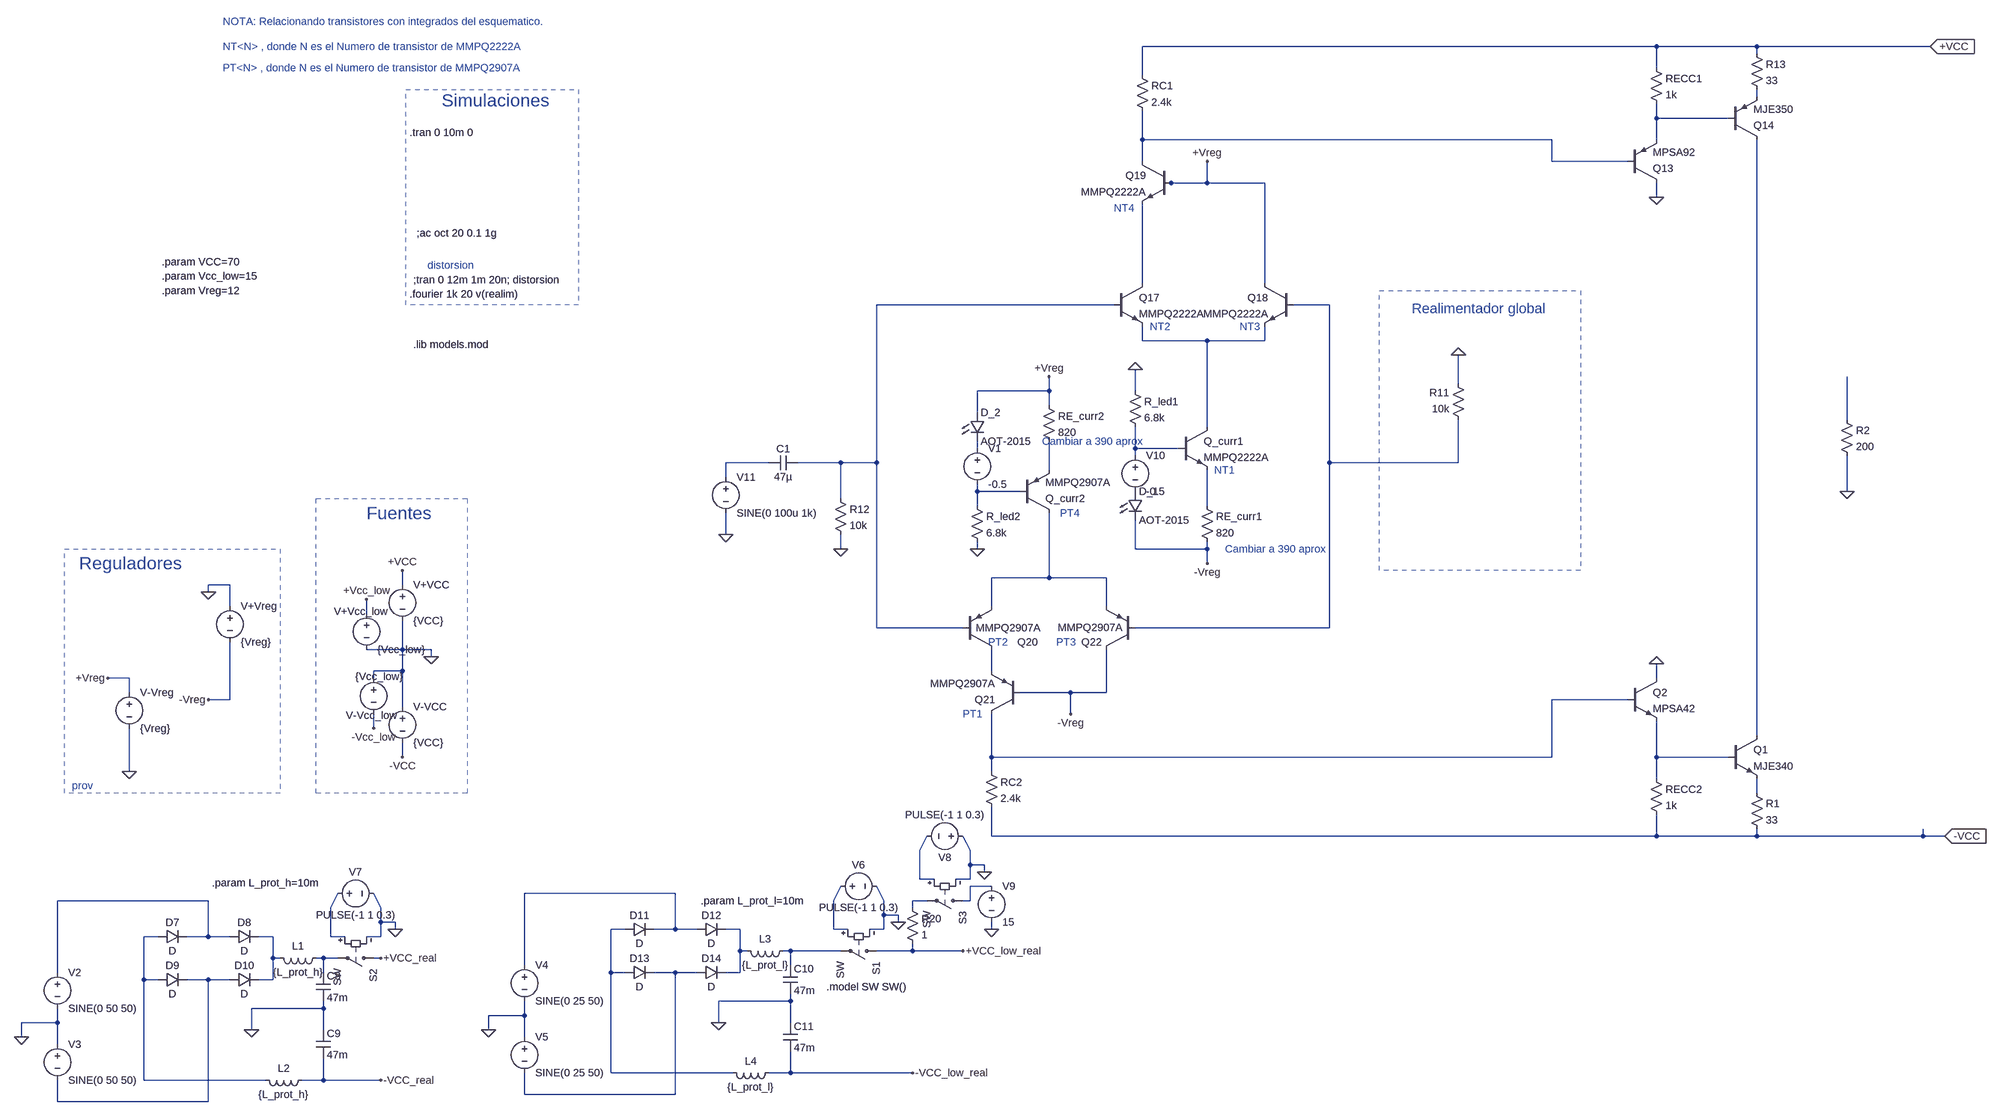
[diagram p0: schematic segunda-etapa.asc]
segunda-etapa.asc, the LTspice schematic file:
Version 4
SHEET 1 6132 1744
WIRE 1680 -752 464 -752
WIRE 1904 -752 1680 -752
WIRE 2688 -752 1904 -752
WIRE 1904 -736 1904 -752
WIRE 1680 -704 1680 -752
WIRE 464 -688 464 -752
WIRE 1904 -640 1904 -656
WIRE 1680 -592 1680 -624
WIRE 1840 -592 1680 -592
WIRE 464 -544 464 -608
WIRE 1392 -544 464 -544
WIRE 1680 -544 1680 -592
WIRE 464 -496 464 -544
WIRE 1392 -496 1392 -544
WIRE 1616 -496 1392 -496
WIRE 528 -448 512 -448
WIRE 608 -448 608 -496
WIRE 608 -448 528 -448
WIRE 736 -448 608 -448
WIRE 1680 -416 1680 -448
WIRE 464 -224 464 -400
WIRE 736 -224 736 -448
WIRE 400 -176 -128 -176
WIRE 880 -176 800 -176
WIRE 464 -96 464 -128
WIRE 608 -96 464 -96
WIRE 736 -96 736 -128
WIRE 736 -96 608 -96
WIRE 1184 0 1184 -64
WIRE 256 16 256 -16
WIRE 256 16 96 16
WIRE 448 16 448 -32
WIRE 256 48 256 16
WIRE 96 64 96 16
WIRE 2336 80 2336 -16
WIRE 608 96 608 -96
WIRE 96 144 96 128
WIRE 448 144 448 96
WIRE 544 144 448 144
WIRE 448 160 448 144
WIRE -368 176 -464 176
WIRE -208 176 -304 176
WIRE -128 176 -128 -176
WIRE -128 176 -208 176
WIRE 880 176 880 -176
WIRE 1184 176 1184 80
WIRE 1184 176 880 176
WIRE 256 192 256 128
WIRE -464 208 -464 176
WIRE 96 240 96 224
WIRE 192 240 96 240
WIRE 2336 240 2336 160
WIRE -208 256 -208 176
WIRE 96 272 96 240
WIRE 608 272 608 192
WIRE -464 336 -464 288
WIRE -208 368 -208 336
WIRE 96 368 96 352
WIRE 448 368 448 304
WIRE 608 368 608 352
WIRE 608 368 448 368
WIRE 608 400 608 368
WIRE 256 432 256 288
WIRE 256 432 128 432
WIRE 384 432 256 432
WIRE -1568 448 -1616 448
WIRE -1184 448 -1184 416
WIRE -1616 464 -1616 448
WIRE -1568 496 -1568 448
WIRE 128 496 128 432
WIRE 384 496 384 432
WIRE -1264 512 -1264 480
WIRE -128 544 -128 176
WIRE 64 544 -128 544
WIRE 880 544 880 176
WIRE 880 544 448 544
WIRE -1184 592 -1184 528
WIRE -1184 592 -1264 592
WIRE -1120 592 -1184 592
WIRE -1120 608 -1120 592
WIRE -1184 640 -1184 592
WIRE -1184 640 -1248 640
WIRE 128 640 128 592
WIRE -1792 656 -1840 656
WIRE -1248 656 -1248 640
WIRE 1680 656 1680 624
WIRE -1792 688 -1792 656
WIRE 304 688 192 688
WIRE 384 688 384 592
WIRE 384 688 304 688
WIRE -1568 704 -1568 576
WIRE -1568 704 -1616 704
WIRE 1616 704 1392 704
WIRE -1184 720 -1184 640
WIRE 304 736 304 688
WIRE -1248 768 -1248 736
WIRE 1904 784 1904 -544
WIRE -1184 832 -1184 800
WIRE 128 832 128 736
WIRE 1392 832 1392 704
WIRE 1392 832 128 832
WIRE 1680 832 1680 752
WIRE 1840 832 1680 832
WIRE -1792 864 -1792 768
WIRE 128 864 128 832
WIRE 1680 880 1680 832
WIRE 1904 912 1904 880
WIRE 128 1008 128 944
WIRE 1680 1008 1680 960
WIRE 1680 1008 128 1008
WIRE 1904 1008 1904 992
WIRE 1904 1008 1680 1008
WIRE 2672 1008 2672 992
WIRE 2672 1008 1904 1008
WIRE 2720 1008 2672 1008
WIRE -32 1040 -16 1008
WIRE 80 1040 64 1008
WIRE 80 1072 80 1040
WIRE 112 1072 80 1072
WIRE 112 1088 112 1072
WIRE -32 1104 -32 1040
WIRE 0 1104 -32 1104
WIRE 80 1104 80 1072
WIRE 80 1104 48 1104
WIRE 128 1120 80 1120
WIRE -576 1136 -912 1136
WIRE -1616 1152 -1952 1152
WIRE -224 1152 -208 1120
WIRE -112 1152 -128 1120
WIRE -16 1152 -48 1152
WIRE 80 1152 80 1120
WIRE 80 1152 64 1152
WIRE -1344 1168 -1328 1136
WIRE -1232 1168 -1248 1136
WIRE -48 1168 -48 1152
WIRE -112 1184 -112 1152
WIRE -80 1184 -112 1184
WIRE -1232 1200 -1232 1168
WIRE -1200 1200 -1232 1200
WIRE -80 1200 -80 1184
WIRE -1200 1216 -1200 1200
WIRE -688 1216 -720 1216
WIRE -576 1216 -576 1136
WIRE -576 1216 -624 1216
WIRE -528 1216 -576 1216
WIRE -432 1216 -464 1216
WIRE -224 1216 -224 1152
WIRE -192 1216 -224 1216
WIRE -112 1216 -112 1184
WIRE -112 1216 -144 1216
WIRE 128 1216 128 1200
WIRE -1728 1232 -1760 1232
WIRE -1616 1232 -1616 1152
WIRE -1616 1232 -1664 1232
WIRE -1568 1232 -1616 1232
WIRE -1472 1232 -1504 1232
WIRE -1344 1232 -1344 1168
WIRE -1312 1232 -1344 1232
WIRE -1232 1232 -1232 1200
WIRE -1232 1232 -1264 1232
WIRE -432 1264 -432 1216
WIRE -416 1264 -432 1264
WIRE -320 1264 -336 1264
WIRE -208 1264 -320 1264
WIRE -48 1264 -48 1248
WIRE -48 1264 -128 1264
WIRE 64 1264 -48 1264
WIRE -1472 1280 -1472 1232
WIRE -1456 1280 -1472 1280
WIRE -1360 1280 -1376 1280
WIRE -1328 1280 -1360 1280
WIRE -1232 1280 -1248 1280
WIRE -912 1296 -912 1136
WIRE -320 1296 -320 1264
WIRE -1952 1312 -1952 1152
WIRE -1360 1312 -1360 1280
WIRE -720 1312 -720 1216
WIRE -688 1312 -720 1312
WIRE -576 1312 -624 1312
WIRE -528 1312 -576 1312
WIRE -432 1312 -432 1264
WIRE -432 1312 -464 1312
WIRE -1760 1328 -1760 1232
WIRE -1728 1328 -1760 1328
WIRE -1616 1328 -1664 1328
WIRE -1568 1328 -1616 1328
WIRE -1472 1328 -1472 1280
WIRE -1472 1328 -1504 1328
WIRE -320 1376 -320 1360
WIRE -320 1376 -480 1376
WIRE -1360 1392 -1360 1376
WIRE -1360 1392 -1520 1392
WIRE -912 1408 -912 1376
WIRE -912 1408 -992 1408
WIRE -1952 1424 -1952 1392
WIRE -1952 1424 -2032 1424
WIRE -480 1424 -480 1376
WIRE -320 1424 -320 1376
WIRE -1520 1440 -1520 1392
WIRE -1360 1440 -1360 1392
WIRE -992 1440 -992 1408
WIRE -2032 1456 -2032 1424
WIRE -912 1456 -912 1408
WIRE -1952 1472 -1952 1424
WIRE -720 1536 -720 1312
WIRE -448 1536 -720 1536
WIRE -320 1536 -320 1488
WIRE -320 1536 -368 1536
WIRE -48 1536 -320 1536
WIRE -1760 1552 -1760 1328
WIRE -1488 1552 -1760 1552
WIRE -1360 1552 -1360 1504
WIRE -1360 1552 -1408 1552
WIRE -1232 1552 -1360 1552
WIRE -912 1584 -912 1536
WIRE -576 1584 -576 1312
WIRE -576 1584 -912 1584
WIRE -1952 1600 -1952 1552
WIRE -1616 1600 -1616 1328
WIRE -1616 1600 -1952 1600
FLAG -1120 608 0
FLAG -1184 416 +VCC
FLAG -1264 480 +Vcc_low
FLAG -1248 768 -Vcc_low
FLAG -1184 832 -VCC
FLAG 2720 1008 -VCC
IOPIN 2720 1008 In
FLAG 2688 -752 +VCC
IOPIN 2688 -752 In
FLAG -208 368 0
FLAG 1680 -416 0
FLAG -1840 656 +Vreg
FLAG -1616 704 -Vreg
FLAG 608 -496 +Vreg
FLAG 608 400 -Vreg
FLAG 256 -16 +Vreg
FLAG 304 736 -Vreg
FLAG 96 368 0
FLAG 448 -32 0
FLAG -1792 864 0
FLAG -1616 464 0
FLAG -2032 1456 0
FLAG -1520 1440 0
FLAG -1232 1280 +VCC_real
FLAG -1232 1552 -VCC_real
FLAG -992 1440 0
FLAG -480 1424 0
FLAG 64 1264 +VCC_low_real
FLAG -48 1536 -VCC_low_real
FLAG -80 1200 0
FLAG -1200 1216 0
FLAG 112 1088 0
FLAG 128 1216 0
FLAG 1184 -64 0
FLAG 1680 624 0
FLAG 2336 240 0
FLAG -464 336 0
SYMBOL voltage -1248 640 R0
WINDOW 0 -62 99 Left 2
WINDOW 3 -41 12 Left 2
WINDOW 123 0 0 Left 2
WINDOW 39 0 0 Left 2
SYMATTR InstName V-Vcc_low
SYMATTR Value {Vcc_low}
SYMBOL voltage -1184 432 R0
WINDOW 123 0 0 Left 2
WINDOW 39 0 0 Left 2
SYMATTR InstName V+VCC
SYMATTR Value {VCC}
SYMBOL voltage -1264 496 R0
WINDOW 0 -72 11 Left 2
WINDOW 123 0 0 Left 2
WINDOW 39 0 0 Left 2
SYMATTR InstName V+Vcc_low
SYMATTR Value {Vcc_low}
SYMBOL voltage -1184 704 R0
WINDOW 123 0 0 Left 2
WINDOW 39 0 0 Left 2
SYMATTR InstName V-VCC
SYMATTR Value {VCC}
SYMBOL res 1200 96 R180
WINDOW 0 36 76 Left 2
WINDOW 3 36 40 Left 2
SYMATTR InstName R11
SYMATTR Value 10k
SYMBOL res -224 240 R0
SYMATTR InstName R12
SYMATTR Value 10k
SYMBOL pnp 1616 -448 M180
SYMATTR InstName Q13
SYMATTR Value MPSA92
SYMBOL pnp 1840 -544 M180
SYMATTR InstName Q14
SYMATTR Value MJE350
SYMBOL res 1888 -752 R0
SYMATTR InstName R13
SYMATTR Value 33
SYMBOL voltage -1568 480 R0
WINDOW 123 0 0 Left 2
WINDOW 39 0 0 Left 2
SYMATTR InstName V+Vreg
SYMATTR Value {Vreg}
SYMBOL npn 544 96 R0
SYMATTR InstName Q_curr1
SYMATTR Value MMPQ2222A
SYMBOL npn 400 -224 R0
SYMATTR InstName Q17
SYMATTR Value MMPQ2222A
SYMBOL npn 800 -224 M0
SYMATTR InstName Q18
SYMATTR Value MMPQ2222A
SYMBOL res 432 0 R0
SYMATTR InstName R_led1
SYMATTR Value 6.8k
SYMBOL res 592 256 R0
SYMATTR InstName RE_curr1
SYMATTR Value 820
SYMBOL LED 432 240 R0
SYMATTR InstName D_1
SYMATTR Value AOT-2015
SYMBOL res 448 -704 R0
SYMATTR InstName RC1
SYMATTR Value 2.4k
SYMBOL npn 528 -496 M0
SYMATTR InstName Q19
SYMATTR Value MMPQ2222A
SYMBOL res 240 32 R0
SYMATTR InstName RE_curr2
SYMATTR Value 820
SYMBOL pnp 192 288 M180
SYMATTR InstName Q_curr2
SYMATTR Value MMPQ2907A
SYMBOL pnp 64 592 M180
WINDOW 0 121 16 Left 2
WINDOW 3 29 48 Left 2
SYMATTR InstName Q20
SYMATTR Value MMPQ2907A
SYMBOL pnp 192 736 R180
SYMATTR InstName Q21
SYMATTR Value MMPQ2907A
SYMBOL res 112 848 R0
SYMATTR InstName RC2
SYMATTR Value 2.4k
SYMBOL pnp 448 592 R180
WINDOW 0 74 16 Left 2
WINDOW 3 28 49 Left 2
SYMATTR InstName Q22
SYMATTR Value MMPQ2907A
SYMBOL LED 80 64 R0
SYMATTR InstName D_2
SYMATTR Value AOT-2015
SYMBOL res 80 256 R0
SYMATTR InstName R_led2
SYMATTR Value 6.8k
SYMBOL res 1664 -720 R0
SYMATTR InstName RECC1
SYMATTR Value 1k
SYMBOL voltage -1792 672 R0
WINDOW 123 0 0 Left 2
WINDOW 39 0 0 Left 2
SYMATTR InstName V-Vreg
SYMATTR Value {Vreg}
SYMBOL voltage -1952 1296 R0
WINDOW 123 0 0 Left 2
WINDOW 39 0 0 Left 2
SYMATTR InstName V2
SYMATTR Value SINE(0 50 50)
SYMBOL diode -1728 1248 R270
WINDOW 0 32 32 VTop 2
WINDOW 3 0 32 VBottom 2
SYMATTR InstName D7
SYMBOL diode -1568 1248 R270
WINDOW 0 32 32 VTop 2
WINDOW 3 0 32 VBottom 2
SYMATTR InstName D8
SYMBOL diode -1728 1344 R270
WINDOW 0 32 32 VTop 2
WINDOW 3 0 32 VBottom 2
SYMATTR InstName D9
SYMBOL diode -1568 1344 R270
WINDOW 0 32 32 VTop 2
WINDOW 3 0 32 VBottom 2
SYMATTR InstName D10
SYMBOL cap -1376 1312 R0
SYMATTR InstName C8
SYMATTR Value 47m
SYMBOL voltage -1952 1456 R0
WINDOW 123 0 0 Left 2
WINDOW 39 0 0 Left 2
SYMATTR InstName V3
SYMATTR Value SINE(0 50 50)
SYMBOL cap -1376 1440 R0
SYMATTR InstName C9
SYMATTR Value 47m
SYMBOL voltage -912 1280 R0
WINDOW 123 0 0 Left 2
WINDOW 39 0 0 Left 2
SYMATTR InstName V4
SYMATTR Value SINE(0 25 50)
SYMBOL diode -688 1232 R270
WINDOW 0 32 32 VTop 2
WINDOW 3 0 32 VBottom 2
SYMATTR InstName D11
SYMBOL diode -528 1232 R270
WINDOW 0 32 32 VTop 2
WINDOW 3 0 32 VBottom 2
SYMATTR InstName D12
SYMBOL diode -688 1328 R270
WINDOW 0 32 32 VTop 2
WINDOW 3 0 32 VBottom 2
SYMATTR InstName D13
SYMBOL diode -528 1328 R270
WINDOW 0 32 32 VTop 2
WINDOW 3 0 32 VBottom 2
SYMATTR InstName D14
SYMBOL cap -336 1296 R0
SYMATTR InstName C10
SYMATTR Value 47m
SYMBOL voltage -912 1440 R0
WINDOW 123 0 0 Left 2
WINDOW 39 0 0 Left 2
SYMATTR InstName V5
SYMATTR Value SINE(0 25 50)
SYMBOL cap -336 1424 R0
SYMATTR InstName C11
SYMATTR Value 47m
SYMBOL ind -1360 1264 R90
WINDOW 0 5 56 VBottom 2
WINDOW 3 32 56 VTop 2
SYMATTR InstName L1
SYMATTR Value {L_prot_h}
SYMBOL ind -1392 1536 R90
WINDOW 0 5 56 VBottom 2
WINDOW 3 32 56 VTop 2
SYMATTR InstName L2
SYMATTR Value {L_prot_h}
SYMBOL ind -320 1248 R90
WINDOW 0 5 56 VBottom 2
WINDOW 3 32 56 VTop 2
SYMATTR InstName L3
SYMATTR Value {L_prot_l}
SYMBOL ind -352 1520 R90
WINDOW 0 5 56 VBottom 2
WINDOW 3 32 56 VTop 2
SYMATTR InstName L4
SYMATTR Value {L_prot_l}
SYMBOL sw -112 1264 R90
SYMATTR InstName S1
SYMBOL voltage -224 1120 R270
WINDOW 0 32 56 VTop 2
WINDOW 3 -32 56 VBottom 2
WINDOW 123 0 0 Left 2
WINDOW 39 0 0 Left 2
SYMATTR InstName V6
SYMATTR Value PULSE(-1 1 0.3)
SYMBOL sw -1232 1280 R90
SYMATTR InstName S2
SYMBOL voltage -1344 1136 R270
WINDOW 0 32 56 VTop 2
WINDOW 3 -32 56 VBottom 2
WINDOW 123 0 0 Left 2
WINDOW 39 0 0 Left 2
SYMATTR InstName V7
SYMATTR Value PULSE(-1 1 0.3)
SYMBOL sw 80 1152 R90
SYMATTR InstName S3
SYMBOL voltage 80 1008 R90
WINDOW 0 32 56 VTop 2
WINDOW 3 -32 56 VBottom 2
WINDOW 123 0 0 Left 2
WINDOW 39 0 0 Left 2
SYMATTR InstName V8
SYMATTR Value PULSE(-1 1 0.3)
SYMBOL voltage 128 1104 R0
WINDOW 123 0 0 Left 2
WINDOW 39 0 0 Left 2
SYMATTR InstName V9
SYMATTR Value 15
SYMBOL res -64 1152 R0
SYMATTR InstName R20
SYMATTR Value 1
SYMBOL voltage 96 128 R0
WINDOW 123 0 0 Left 2
WINDOW 39 0 0 Left 2
SYMATTR InstName V1
SYMATTR Value -0.5
SYMBOL voltage 448 144 R0
WINDOW 123 0 0 Left 2
WINDOW 39 0 0 Left 2
SYMATTR InstName V10
SYMATTR Value -0.5
SYMBOL npn 1840 784 R0
SYMATTR InstName Q1
SYMATTR Value MJE340
SYMBOL res 1888 896 R0
SYMATTR InstName R1
SYMATTR Value 33
SYMBOL npn 1616 656 R0
SYMATTR InstName Q2
SYMATTR Value MPSA42
SYMBOL res 1664 864 R0
SYMATTR InstName RECC2
SYMATTR Value 1k
SYMBOL res 2320 64 R0
SYMATTR InstName R2
SYMATTR Value 200
SYMBOL cap -304 160 R90
WINDOW 0 0 32 VBottom 2
WINDOW 3 32 32 VTop 2
SYMATTR InstName C1
SYMATTR Value 47µ
SYMBOL voltage -464 192 R0
WINDOW 123 0 0 Left 2
WINDOW 39 0 0 Left 2
SYMATTR InstName V11
SYMATTR Value SINE(0 100u 1k)
TEXT -1168 -560 Left 2 !.tran 0 10m 0
TEXT -1168 -200 Left 2 !.fourier 1k 20 v(realim)
TEXT -1264 288 Left 4 ;Fuentes
TEXT -1096 -632 Left 4 ;Simulaciones
TEXT -1160 -232 Left 2 !;tran 0 12m 1m 20n; distorsion
TEXT -1128 -264 Left 2 ;distorsion
TEXT -1152 -336 Left 2 !;ac oct 20 0.1 1g
TEXT -1160 -88 Left 2 !.lib models.mod
TEXT -1904 400 Left 4 ;Reguladores
TEXT -1920 896 Left 2 ;prov
TEXT 1080 -168 Left 3 ;Realimentador global
TEXT 480 -128 Left 2 ;NT2
TEXT 680 -128 Left 2 ;NT3
TEXT 624 192 Left 2 ;NT1
TEXT 400 -392 Left 2 ;NT4
TEXT 120 576 Left 2 ;PT2
TEXT -1584 -752 Left 2 ;NT<N> , donde N es el Numero de transistor de MMPQ2222A
TEXT -1584 -704 Left 2 ;PT<N> , donde N es el Numero de transistor de MMPQ2907A
TEXT -1584 -808 Left 2 ;NOTA: Relacionando transistores con integrados del esquematico.
TEXT 64 736 Left 2 ;PT1
TEXT 272 576 Left 2 ;PT3
TEXT 280 288 Left 2 ;PT4
TEXT -1720 -272 Left 2 !.param VCC=70
TEXT -1720 -240 Left 2 !.param Vcc_low=15
TEXT -1720 -208 Left 2 !.param Vreg=12
TEXT -1608 1112 Left 2 !.param L_prot_h=10m
TEXT -520 1152 Left 2 !.param L_prot_l=10m
TEXT -240 1344 Left 2 !.model SW SW()
TEXT 648 368 Left 2 ;Cambiar a 390 aprox
TEXT 240 128 Left 2 ;Cambiar a 390 aprox
RECTANGLE Normal -1040 912 -1376 256 2
RECTANGLE Normal -792 -176 -1176 -656 2
RECTANGLE Normal -1456 912 -1936 368 2
RECTANGLE Normal 1456 416 1008 -208 2

The netlist it stands for:
* segunda-etapa.asc
V-Vcc_low 0 -Vcc_low {Vcc_low}
V+VCC +VCC 0 {VCC}
V+Vcc_low +Vcc_low 0 {Vcc_low}
V-VCC 0 -VCC {VCC}
R11 N006 0 10k
R12 N005 0 10k
Q13 0 N003 N002 0 MPSA92
Q14 N018 N002 N001 0 MJE350
R13 +VCC N001 33
V+Vreg 0 -Vreg {Vreg}
Q_curr1 N007 N010 N014 0 MMPQ2222A
Q17 N004 N005 N007 0 MMPQ2222A
Q18 +Vreg N006 N007 0 MMPQ2222A
R_led1 0 N010 6.8k
RE_curr1 N014 -Vreg 820
D_1 P001 -Vreg AOT-2015
RC1 +VCC N003 2.4k
Q19 N003 +Vreg N004 0 MMPQ2222A
RE_curr2 +Vreg N012 820
Q_curr2 N015 N013 N012 0 MMPQ2907A
Q20 N016 N005 N015 0 MMPQ2907A
Q21 N017 -Vreg N016 0 MMPQ2907A
RC2 N017 -VCC 2.4k
Q22 -Vreg N006 N015 0 MMPQ2907A
D_2 +Vreg N009 AOT-2015
R_led2 N013 0 6.8k
RECC1 +VCC N002 1k
V-Vreg +Vreg 0 {Vreg}
V2 N024 0 SINE(0 50 50)
D7 N030 N024 D
D8 N024 N031 D
D9 N030 N035 D
D10 N035 N031 D
C8 N033 0 47m
V3 0 N035 SINE(0 50 50)
C9 0 -VCC_real 47m
V4 N023 0 SINE(0 25 50)
D11 N028 N023 D
D12 N023 N029 D
D13 N028 N034 D
D14 N034 N029 D
C10 N032 0 47m
V5 0 N034 SINE(0 25 50)
C11 0 -VCC_low_real 47m
L1 N033 N031 {L_prot_h}
L2 -VCC_real N030 {L_prot_h}
L3 N032 N029 {L_prot_l}
L4 -VCC_low_real N028 {L_prot_l}
S1 +VCC_low_real N032 N025 0 SW
V6 N025 0 PULSE(-1 1 0.3)
S2 +VCC_real N033 N027 0 SW
V7 N027 0 PULSE(-1 1 0.3)
S3 N022 N026 N021 0 SW
V8 0 N021 PULSE(-1 1 0.3)
V9 N022 0 15
R20 N026 +VCC_low_real 1
V1 N009 N013 -0.5
V10 N010 P001 -0.5
Q1 N018 N019 N020 0 MJE340
R1 N020 -VCC 33
Q2 0 N017 N019 0 MPSA42
RECC2 N019 -VCC 1k
R2 N008 0 200
C1 N005 N011 47µ
V11 N011 0 SINE(0 100u 1k)
.model D D
.lib standard.dio
.model NPN NPN
.model PNP PNP
.lib standard.bjt
.tran 0 10m 0
.fourier 1k 20 v(realim)
* Fuentes
* Simulaciones
;tran 0 12m 1m 20n; distorsion
* distorsion
;ac oct 20 0.1 1g
.lib models.mod
* Reguladores
* prov
* Realimentador global
* NT2
* NT3
* NT1
* NT4
* PT2
* NT<N> , donde N es el Numero de transistor de MMPQ2222A
* PT<N> , donde N es el Numero de transistor de MMPQ2907A
* NOTA: Relacionando transistores con integrados del esquematico.
* PT1
* PT3
* PT4
.param VCC=70
.param Vcc_low=15
.param Vreg=12
.param L_prot_h=10m
.param L_prot_l=10m
.model SW SW()
* Cambiar a 390 aprox
* Cambiar a 390 aprox
.backanno
.end